# EAGLE design amper (EAGLE 7.6.0)

## Sheet 1 of 2
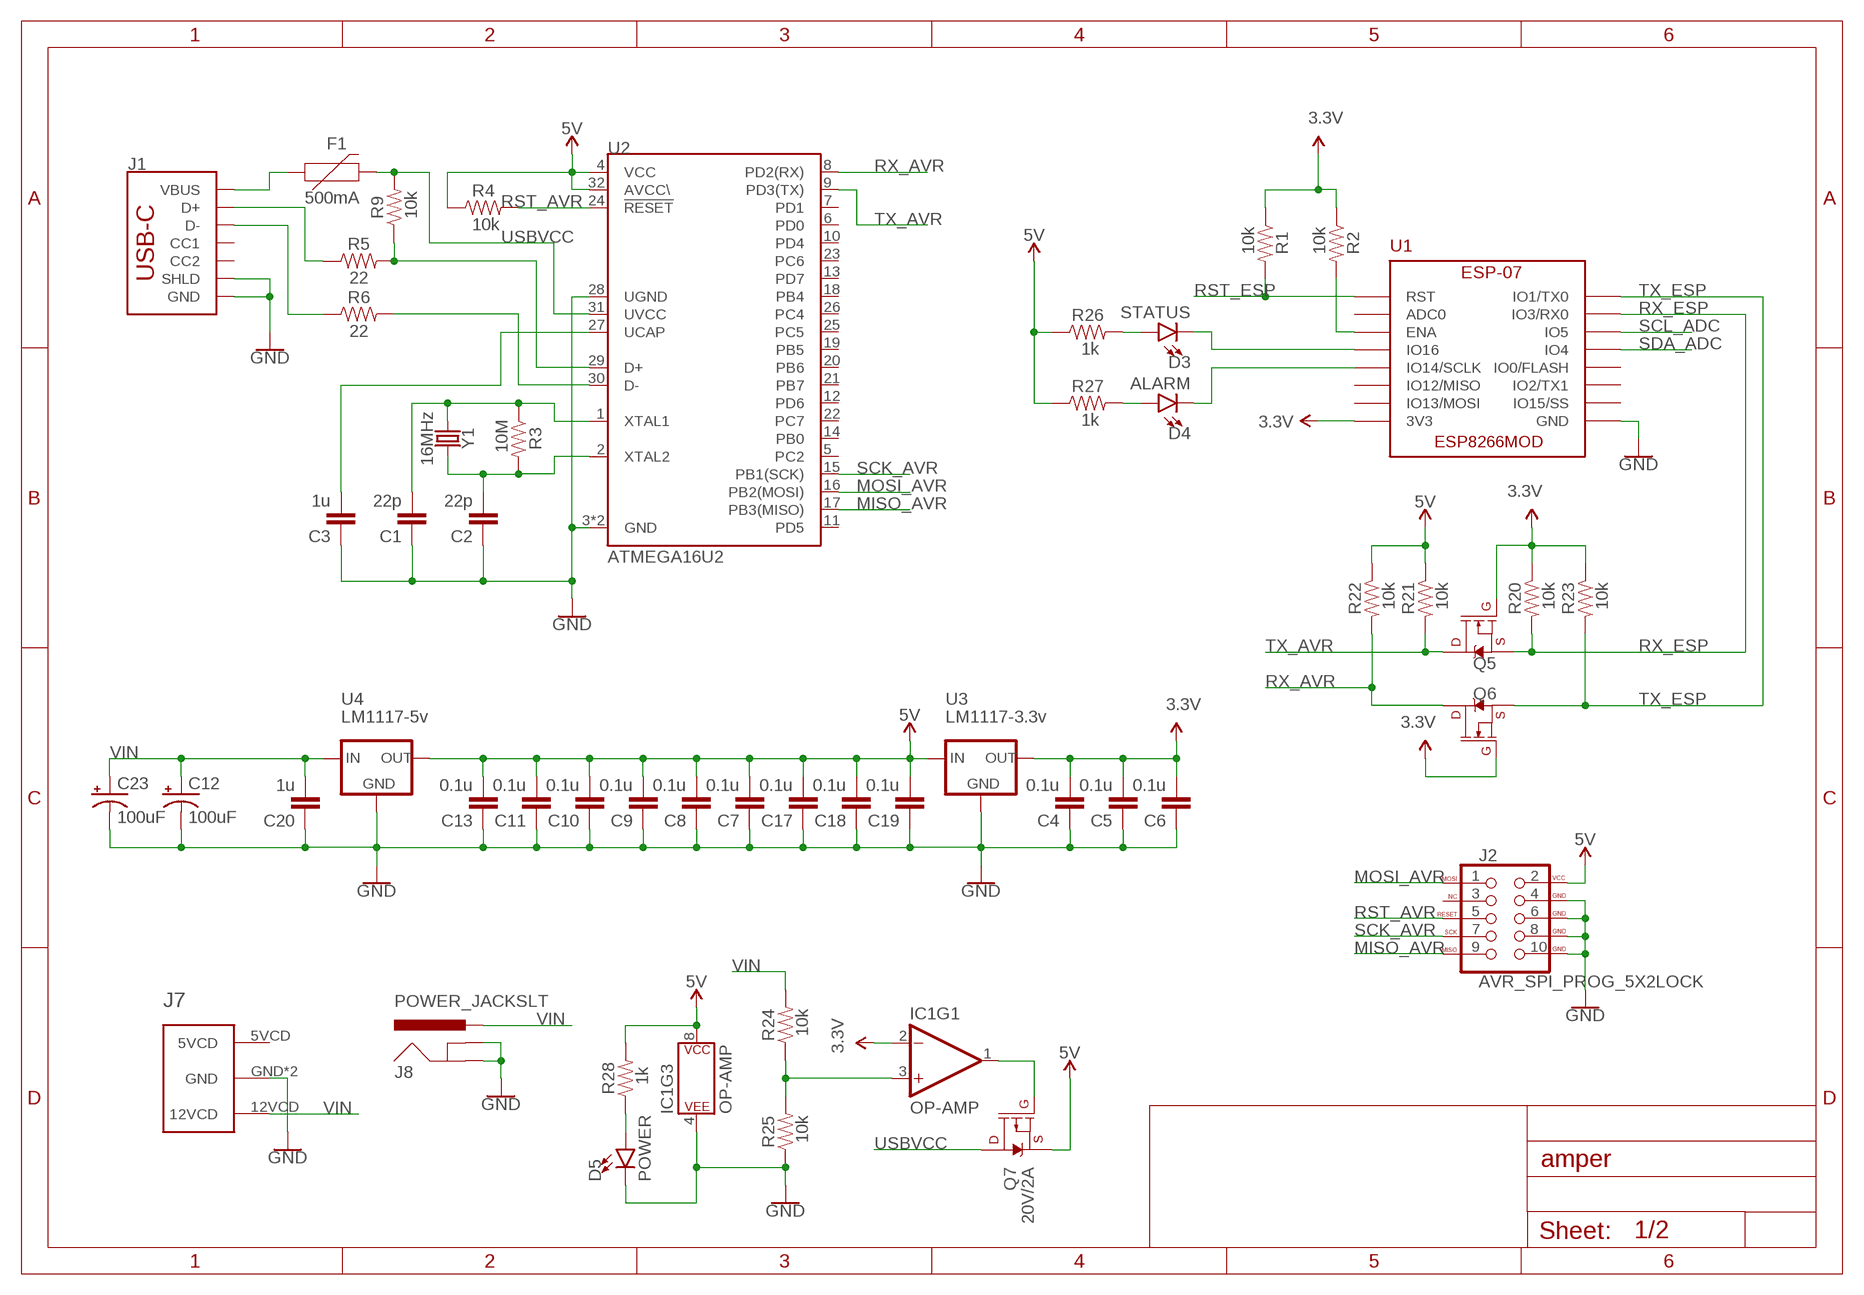
[diagram p0: schematic, sheet 1]

### Parts
C1  22p  CAP-0805  [0805]
C2  22p  CAP-0805  [0805]
C3  1u  CAP-0805  [0805]
C4  0.1u  CAP-0805  [0805]
C5  0.1u  CAP-0805  [0805]
C6  0.1u  CAP-0805  [0805]
C7  0.1u  CAP-0805  [0805]
C8  0.1u  CAP-0805  [0805]
C9  0.1u  CAP-0805  [0805]
C10  0.1u  CAP-0805  [0805]
C11  0.1u  CAP-0805  [0805]
C12  100uF  100UF-POLAR-25V-20%(ELEC)  [PANASONIC_D]
C13  0.1u  CAP-0805  [0805]
C17  0.1u  CAP-0805  [0805]
C18  0.1u  CAP-0805  [0805]
C19  0.1u  CAP-0805  [0805]
C20  1u  CAP-0805  [0805]
C23  100uF  100UF-POLAR-25V-20%(ELEC)  [PANASONIC_D]
D3  STATUS  LED-YELLOW0603  [LED-0603]
D4  ALARM  LED-YELLOW0603  [LED-0603]
D5  POWER  LED-YELLOW0603  [LED-0603]
F1  500mA  PPTC_16V_2.5A  [1812]
IC1  OP-AMP  OPAMP-DUALU  [SO08]
J1  USB_C_2-LAYER_PADS  [USB-C-16P-2LAYER-PADS]
J2  AVR_SPI_PROG_5X2LOCK  [2X5-SHROUDED_LOCK]
J7  MOLEX-CPU-POWER  [MOLEX-5.08-4PIN]
J8  POWER_JACKSLT  [POWER_JACK_SLOT]
Q5  220mA/50V/3.5Ω  MOSFET-NCH-BSS138  [SOT23-3]
Q6  220mA/50V/3.5Ω  MOSFET-NCH-BSS138  [SOT23-3]
Q7  20V/2A  MOSFET_PCH-DMG2305UX-7  [SOT23-3]
R1  10k  RESISTOR0805  [0805]
R2  10k  RESISTOR0805  [0805]
R3  10M  RESISTOR0805  [0805]
R4  10k  RESISTOR0805  [0805]
R5  22  RESISTOR0805  [0805]
R6  22  RESISTOR0805  [0805]
R9  10k  RESISTOR0805  [0805]
R20  10k  RESISTOR0805  [0805]
R21  10k  RESISTOR0805  [0805]
R22  10k  RESISTOR0805  [0805]
R23  10k  RESISTOR0805  [0805]
R24  10k  RESISTOR0805  [0805]
R25  10k  RESISTOR0805  [0805]
R26  1k  RESISTOR0805  [0805]
R27  1k  RESISTOR0805  [0805]
R28  1k  RESISTOR0805  [0805]
U1  ESP-07  [ESP-07]
U2  ATMEGA16U2  [QFN32]
U3  LM1117-3.3v  V_REG_LD1117VXXLD1117-SMD  [SOT223]
U4  LM1117-5v  V_REG_LD1117VXXLD1117-SMD  [SOT223]
Y1  16MHz  CRYSTAL-16MHZSMD-5X3.2  [CRYSTAL-SMD-5X3.2-4PAD]

### Nets
3.3V: C4.2 C5.2 C6.2 IC1.2(-IN) Q5.1(G) Q6.1(G) R1.1 R2.1 R20.1 R23.1 U1.3V3 U3.2(OUT) ; also sheet 2
5V: C7.2 C8.2 C9.2 C10.2 C11.2 C13.2 C17.2 C18.2 C19.2 IC1.8(P$V+) J2.2(VCC) Q7.2(S) R4.1 R21.1 R22.1 R26.1 R27.1 R28.2 U2.4(VCC) U2.32(AVCC\) U3.3(IN) U4.2(OUT) ; also sheet 2
GND: C1.1 C2.1 C3.1 C4.1 C5.1 C6.1 C7.1 C8.1 C9.1 C10.1 C11.1 C12.- C13.1 C17.1 C18.1 C19.1 C20.1 C23.- D5.C IC1.4(P$V-) J1.GND J1.GND2(GND) J1.SHLD1(SHLD) J1.SHLD2(SHLD) J1.SHLD3(SHLD) J1.SHLD4(SHLD) J2.4(GND) J2.6(GND) J2.8(GND) J2.10(GND) J7.GND J7.GND2(GND) J8.GND@1(GNDBREAK) J8.GND@2(GND) R25.1 U1.GND U2.3(GND) U2.28(UGND) U2.EP(GND) U3.1(GND) U4.1(GND) ; also sheet 2
MISO_AVR: J2.9(MISO) U2.17(PB3(MISO))
MOSI_AVR: J2.1(MOSI) U2.16(PB2(MOSI))
N$1: C1.2 R3.1 U2.1(XTAL1) Y1.1
N$2: C2.2 R3.2 U2.2(XTAL2) Y1.3
N$3: C3.2 U2.27(UCAP)
N$6: R6.2 U2.30(D-)
N$7: R5.2 R9.1 U2.29(D+)
N$8: J1.A6(D+) J1.B6(D+) R5.1
N$9: J1.A7(D-) J1.B7(D-) R6.1
N$10: F1.1 J1.VBUS1(VBUS) J1.VBUS2(VBUS)
N$14: R2.2 U1.ENA
N$28: IC1.1(OUT) Q7.1(G)
N$29: IC1.3(+IN) R24.1 R25.2
N$30: D3.C U1.I016(IO16)
N$31: D4.C U1.IO14(IO14/SCLK)
N$32: D3.A R26.2
N$33: D4.A R27.2
N$36: D5.A R28.1
RST_AVR: J2.5(RESET) R4.2 U2.24(!RESET)
RST_ESP: R1.2 U1.RST
RX_AVR: Q6.3(D) R22.2 U2.8(PD2(RX))
RX_ESP: Q5.2(S) R20.2 U1.RX0(IO3/RX0)
SCK_AVR: J2.7(SCK) U2.15(PB1(SCK))
SCL_ADC: U1.IO5 ; also sheet 2
SDA_ADC: U1.IO4 ; also sheet 2
TX_AVR: Q5.3(D) R21.2 U2.9(PD3(TX))
TX_ESP: Q6.2(S) R23.2 U1.TX0(IO1/TX0)
USBVCC: F1.2 Q7.3(D) R9.2 U2.31(UVCC)
VIN: C12.+ C20.2 C23.+ J7.12VCD J8.PWR R24.2 U4.3(IN)
Unconnected: IC1.5(+IN) IC1.6(-IN) IC1.7(OUT) J1.A5(CC1) J1.B5(CC2) J2.3(NC) J7.5VCD U1.ADC(ADC0) U1.IO0(IO0/FLASH) U1.IO2(IO2/TX1) U1.IO12(IO12/MISO) U1.IO13(IO13/MOSI) U1.IO15(IO15/SS) U2.5(PC2) U2.6(PD0) U2.7(PD1) U2.10(PD4) U2.11(PD5) U2.12(PD6) U2.13(PD7) U2.14(PB0) U2.18(PB4) U2.19(PB5) U2.20(PB6) U2.21(PB7) U2.22(PC7) U2.23(PC6) U2.25(PC5) U2.26(PC4)

## Sheet 2 of 2
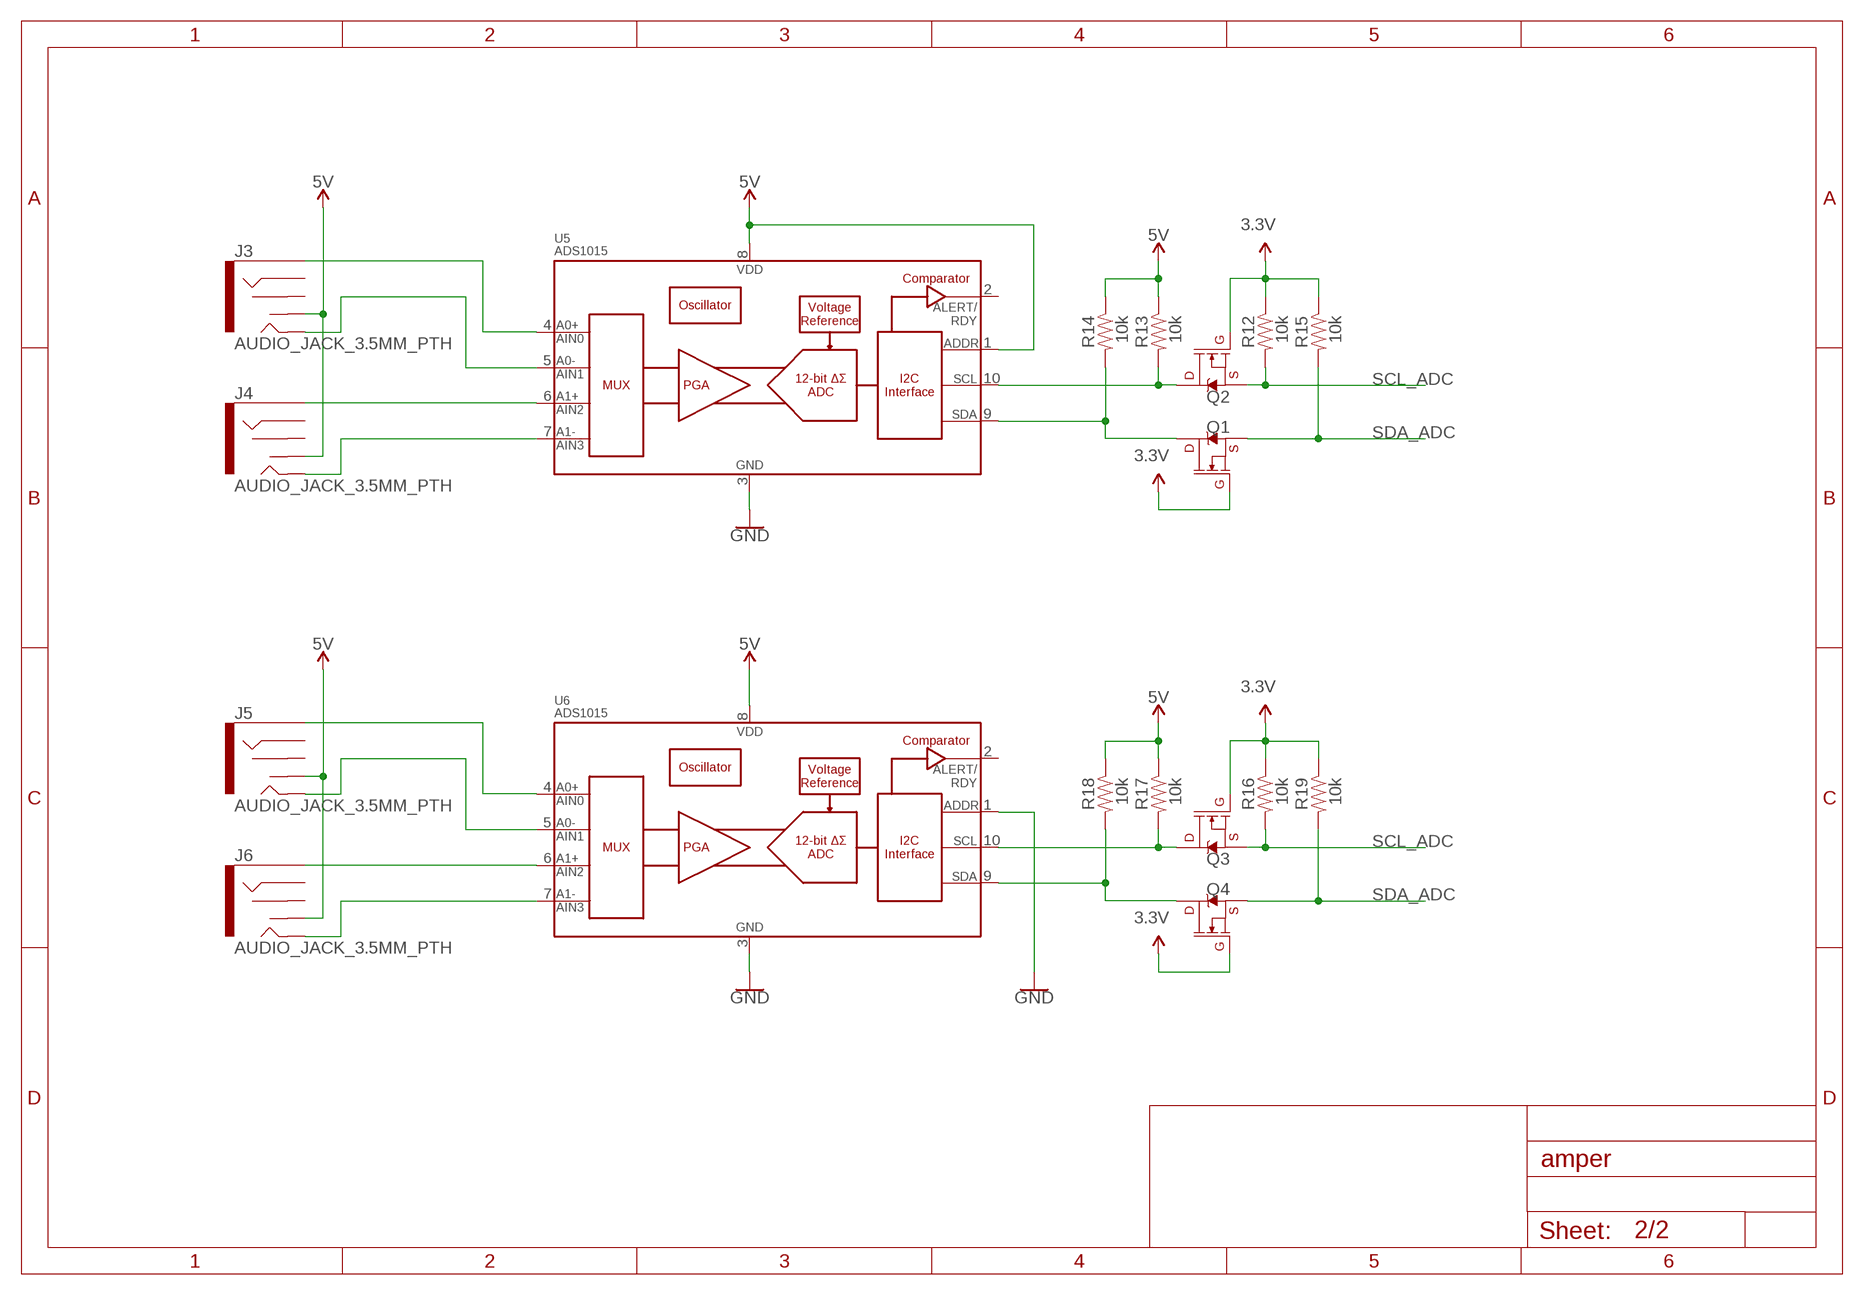
[diagram p1: schematic, sheet 2]

### Parts
J3  AUDIO_JACK_3.5MM_PTH  [AUDIO-JACK]
J4  AUDIO_JACK_3.5MM_PTH  [AUDIO-JACK]
J5  AUDIO_JACK_3.5MM_PTH  [AUDIO-JACK]
J6  AUDIO_JACK_3.5MM_PTH  [AUDIO-JACK]
Q1  220mA/50V/3.5Ω  MOSFET-NCH-BSS138  [SOT23-3]
Q2  220mA/50V/3.5Ω  MOSFET-NCH-BSS138  [SOT23-3]
Q3  220mA/50V/3.5Ω  MOSFET-NCH-BSS138  [SOT23-3]
Q4  220mA/50V/3.5Ω  MOSFET-NCH-BSS138  [SOT23-3]
R12  10k  RESISTOR0805  [0805]
R13  10k  RESISTOR0805  [0805]
R14  10k  RESISTOR0805  [0805]
R15  10k  RESISTOR0805  [0805]
R16  10k  RESISTOR0805  [0805]
R17  10k  RESISTOR0805  [0805]
R18  10k  RESISTOR0805  [0805]
R19  10k  RESISTOR0805  [0805]
U5  ADS1015  [MSOP10]
U6  ADS1015  [MSOP10]

### Nets
3.3V: Q1.1(G) Q2.1(G) Q3.1(G) Q4.1(G) R12.1 R15.1 R16.1 R19.1 ; also sheet 1
5V: J3.TSH J4.TSH J5.TSH J6.TSH R13.1 R14.1 R17.1 R18.1 U5.1(ADDR) U5.8(VDD) U6.8(VDD) ; also sheet 1
GND: U5.3(VSS) U6.1(ADDR) U6.3(VSS) ; also sheet 1
N$16: J3.SLEEVE U5.4(AIN0)
N$17: J3.TIP U5.5(AIN1)
N$18: J4.TIP U5.7(AIN3)
N$19: J4.SLEEVE U5.6(AIN2)
N$20: J5.TIP U6.5(AIN1)
N$21: Q1.3(D) R14.2 U5.9(SDA)
N$22: J5.SLEEVE U6.4(AIN0)
N$23: Q2.3(D) R13.2 U5.10(SCL)
N$24: J6.TIP U6.7(AIN3)
N$25: J6.SLEEVE U6.6(AIN2)
N$26: Q3.3(D) R17.2 U6.10(SCL)
N$27: Q4.3(D) R18.2 U6.9(SDA)
SCL_ADC: Q2.2(S) Q3.2(S) R12.2 R16.2 ; also sheet 1
SDA_ADC: Q1.2(S) Q4.2(S) R15.2 R19.2 ; also sheet 1
Unconnected: J3.RING J3.RSH J4.RING J4.RSH J5.RING J5.RSH J6.RING J6.RSH U5.2(ALERT/RDY) U6.2(ALERT/RDY)

## Library data of the parts
C1-C11 C13 C17-C20 = SparkFun-Capacitors:CAP
C12 C23 = SparkFun-Capacitors:100UF-POLAR: 100µF polarized capacitors A capacitor is a passive two-terminal electrical component used to store electrical energy temporarily in an electric field.; PROD_ID: CAP-12547
D3-D5 = SparkFun-LED:LED-YELLOW: Yellow SMD LED Used in manufacturing several products at SparkFun. Packages: 0603 - SMD 0603 package[Product Link] <http://www.kingbrightusa.com/product.asp?catalog_name=LED&product_id=APT1608SYCK> 0603 -SMART - SMART SMD 0603 package (more efficient/more expensive) [Product Link] <http://www.osram-os.com/osram_os/en/products/product-catalog/led-light-emitting-diodes/smartled-0603/ly-l29k/index.jsp> LilyPad - SMD1206 package[Product Datasheet] <https://www.sparkfun.com/datasheets/DevTools/LilyPad/Q150YUS4.pdf> SparkFun Products: Blynk Board <https://www.sparkfun.com/products/13794> IOIO-OTG <https://www.sparkfun.com/products/13613> XBee Explorer Serial <https://www.sparkfun.com/products/13225>; PROD_ID: DIO-09003; VALUE: Yellow
F1 = SparkFun-Fuses:PPTC: Resettable Fuse PPTC Resettable Fuse. Really a sort of resistor with a polymeric positive temperature coefficient whose resistance increases dramatically with an increase in temperature. When heated by the power passing through the resistance rises causing the current to be limited, protecting the circuit. This is achieved by the transition of the polymer from a crystalline to an amorphous state where the conductive carbon separates breaking the conductive pathways found in the cool crystalline structure. When a PPTC cools back down it resumes conducting letting the circuit turn back on. SparkFun Products: SparkFun RedBoard - Programmed with Arduino <https://www.sparkfun.com/products/12757> Pro Micro - 5V/16MHz <https://www.sparkfun.com/products/12640> Arduino Pro 328 - 5V/16MHz <https://www.sparkfun.com/products/10915> MP3 Trigger <https://www.sparkfun.com/products/13720>; PROD_ID: RES-14390; VALUE: 16V/2.5A(5A TRIP)
IC1 = SparkFun-IC-Amplifiers:OPAMP-DUAL: Generic op-amp footprint This component is for the standard 358 pinning of a dual op-amp From the LM358 datasheet: Pin 1: Output A Pin 2: Inverting Input A Pin 3: Non-Inverting Input A Pin 4: Gnd Pin 5: Non-Inverting Input B Pin 6: Inverting Input B Pin 7: Output B Pin 8: V+; PROD_ID: NA-XXXXX
J1 = SparkFun-Connectors:USB_C: USB Type C 16Pin Connector Super Speed pins not available on the 16-pin purely SMD connector so this part is best for USB 2.0 implementations. D1 and D2 are tied together enabling D+/- no matter which way the cable is plugged into the connector. The two channel configuration pins (CC1/2) are exposed. These are normally connected to ground via 5.1k resistors but can be reconfigured for high current/high power applications. **4-LAYER BOARD WARNING!!** If designing 4-layer board, make sure to select the variant _4-LAYER-ISOLATED. The linked footprint (USB-C-16-4LAYER-ISOLATED) includes some very necessary cutout polygons in the inner layers (2 and 15). This prevents the PTH mounting shield legs on the USB connector from electrically connecting any other polygons on the inner layers (usually VCC and GND).; PROD_ID: CONN-14122
J2 = SparkFun-Connectors:AVR_SPI_PROG_5X2: AVR 10-pin ICSP Header This is the standard AVR In Circuit Serial Programming header. Minimal, but includes pin one indicator. Works with standard Olimex programmers. SparkFun Products: 2x5 AVR ICSP Male Header <https://www.sparkfun.com/products/778> - PTH 2x5 Pin Shrouded Header <https://www.sparkfun.com/products/8506> - PTH2; PROD_ID: CONN-08671; SF_ID: PRT-08506
J3-J6 = SparkFun-Connectors:AUDIO_JACK_3.5MM: Audio Jack 3.5mm variants of PTH and SMT stereo audio jack with bypass switches. SparkFun Products: SparkFun SparkPunk Sound Kit <[https://www.sparkfun.com/products/11177]> - PTH MP3 Trigger <https://www.sparkfun.com/products/13720> -3.5mm SMD SparkFun PicoBoard <https://www.sparkfun.com/products/11888>- 2.5mm SMD; PROD_ID: CONN-08774; SF_ID: PRT-08032
J7 = Cominer-Connectors:MOLEX-CPU-POWER
J8 = SparkFun-Connectors:POWER_JACK: Power Jack Connector This is the standard 5.5mm barrel jack for power. The PTH is the most common, proven, reliable, footprint. The Slot footprint only works if the mill layer is transmitted to the PCB fab house so be warned. Here are the connectors we sell at SparkFun: DC Barrel Power Jack/Connector <https://www.sparkfun.com/products/119> (PRT-00119) DC Barrel Power Jack/Connector (SMD) <https://www.sparkfun.com/products/12748> (PRT-12748) DC Barrel Jack Adapter - Breadboard Compatible <https://www.sparkfun.com/products/10811> (PRT-10811) It is used on this SparkFun product (and many, many others): SparkFun RedBoard - Programmed with Arduino <https://www.sparkfun.com/products/12757> (DEV-12757) Also, if you need a mating power supply or connector, please check these out: Wall Adapter Power Supply - 9VDC 650mA <https://www.sparkfun.com/products/298> (TOL-00298) DC Barrel Jack Adapter - Male <https://www.sparkfun.com/products/10287> (PRT-10287); PROD_ID: PRT-00119
Q1-Q6 = SparkFun-DiscreteSemi:MOSFET-NCH: N-channel MOSFETs Voltage controlled devices that allow control of high current outputs. SparkFun Products: SparkFun OpenScale <https://www.sparkfun.com/products/13261> SparkFun Digital Sandbox <https://www.sparkfun.com/products/12651> SparkFun Monster Moto Shield <https://www.sparkfun.com/products/10182> SparkFun MOSFET Power Controller <https://www.sparkfun.com/products/11214>; PROD_ID: TRANS-00830
Q7 = SparkFun-DiscreteSemi:MOSFET_PCH: P-channel MOSFETs Voltage controlled devices that allow control of high current outputs. SparkFun Products: SparkFun ESP32 Thing <https://www.sparkfun.com/products/13907> SparkFun ESP8266 Thing <https://www.sparkfun.com/products/13231> SparkFun Pi Servo HAT V2 <https://www.sparkfun.com/products/15316> DMG2305UX-7 (20V/4.2A/SOT23-3); PROD_ID: TRAN-14388; VALUE: 20V/4.2A/52mΩ/1.4W
R1-R6 R9 R12-R28 = SparkFun-Resistors:RESISTOR: Generic Resistor Package
U1 = cominer library:ESP-07: Esp-07 Module Wifi ESP8266MOD by COMINER Team
U2 = Cominer-Microcontroller:ATMEGA16U2
U3 U4 = SparkFun-IC-Power:V_REG_LD1117VXX: LD1117VXX voltage regulator. We carry the 3.3V version (COM-00526) in TO-220 package.; PROD_ID: VREG-13917
U5 U6 = SparkFun-IC-Conversion:ADS1015: ADS1015 12-BIT ADC 12-Bit Del-Sig ADC Four single-ended inputs or two differential inputs Internal PGA I2C interface 2.0-5.5V SparkFun Products SparkFun Block for Intel Edison - ADC <https://www.sparkfun.com/products/13770> (DEV-13770); PROD_ID: IC-12270
Y1 = SparkFun-Clocks:CRYSTAL-16MHZ: 16MHz Crystal Digikey Example <http://www.digikey.com/product-search/en?keywords=535-9122-1-ND> Frequency: 16MHz Frequency Stability: ±50ppm Frequency Tolerance: ±20ppm Load Capacitance: 18pF SparkFun Products: Pro Micro -5V/16MHz <https://www.sparkfun.com/products/12640> SparkFun Serial Enabled LCD Kit <https://www.sparkfun.com/products/10097>; PROD_ID: XTAL-08218; SF_ID: COM-00094

## Board
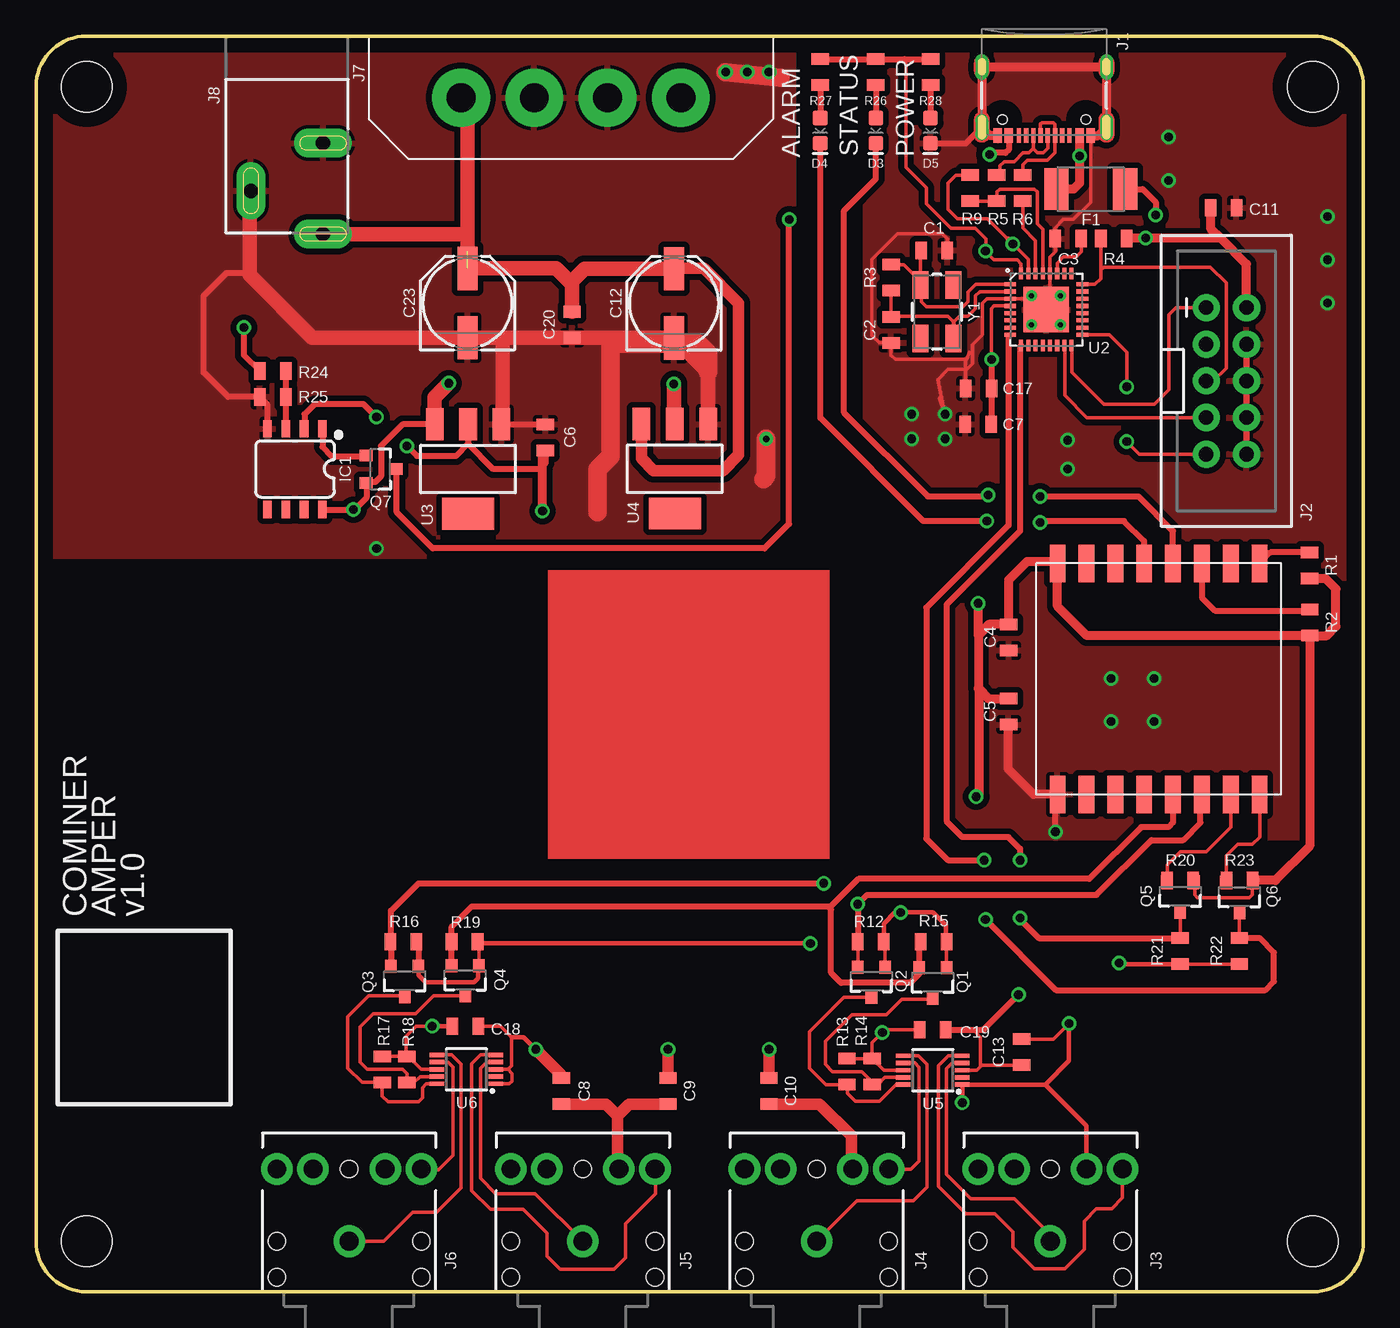
[diagram p2: board, top side]
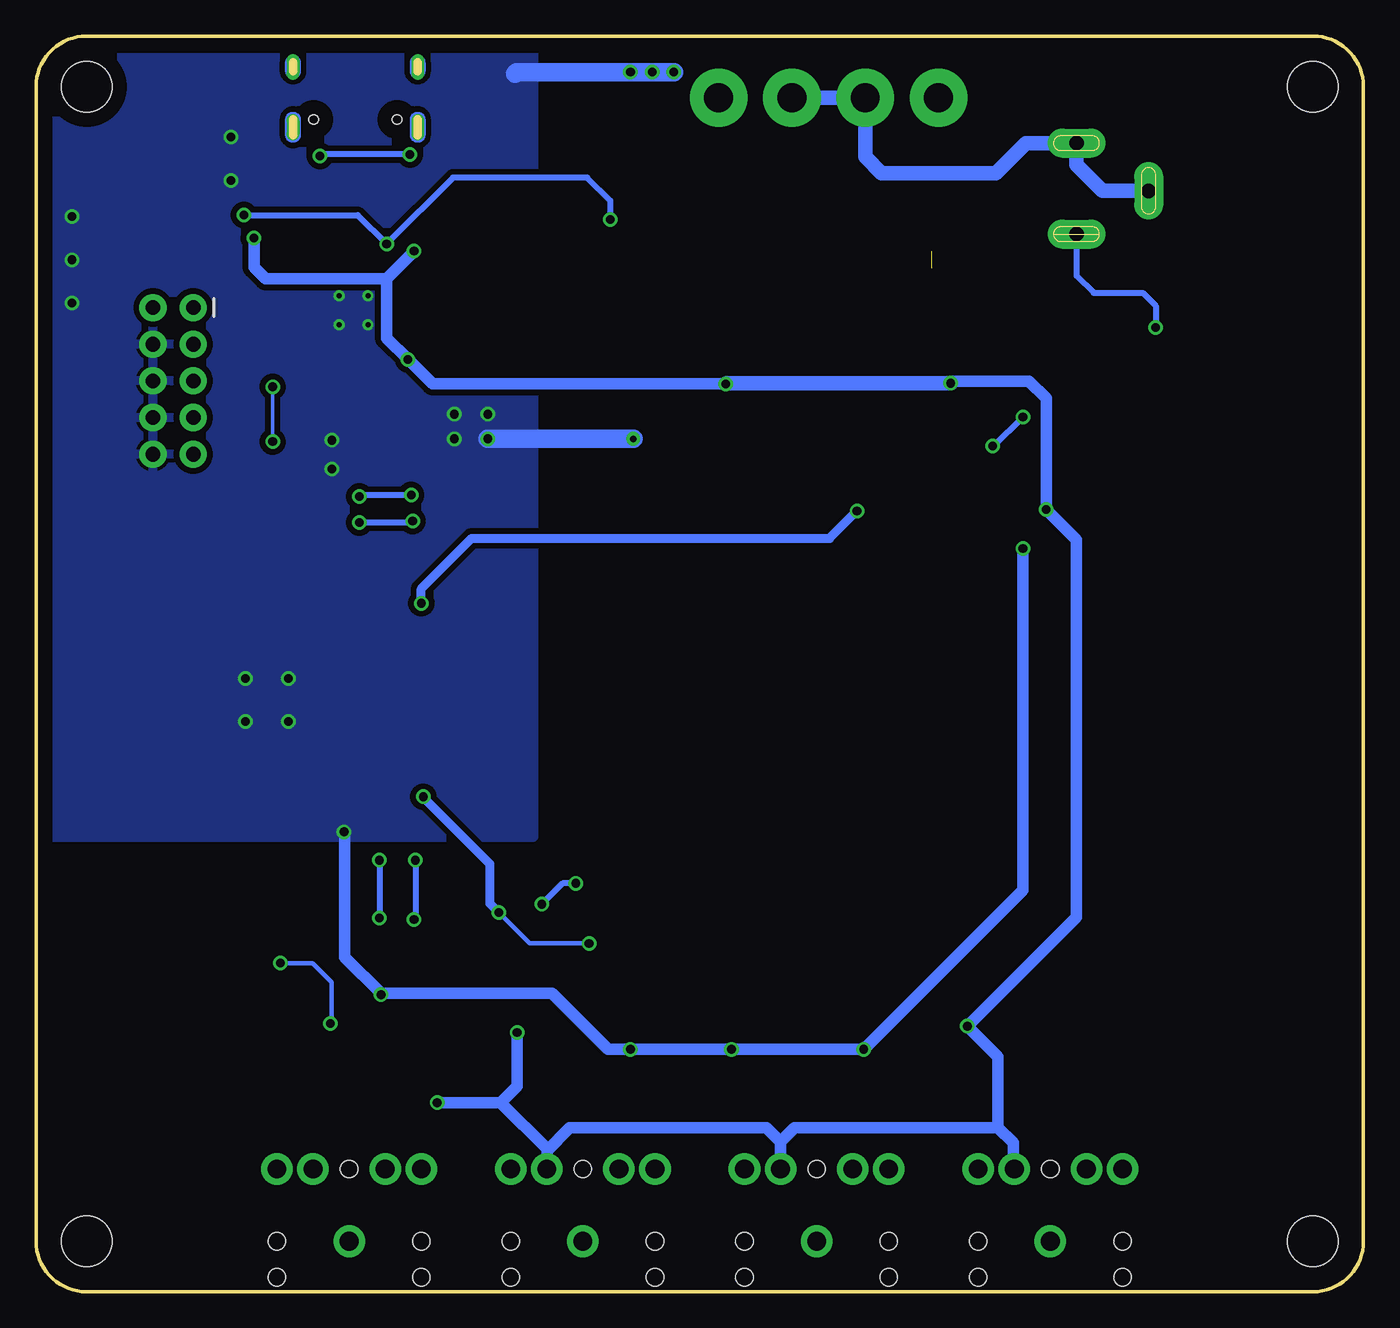
[diagram p3: board, bottom side, seen from below]

Size 92 x 87 mm. Coordinates in mm from the lower left corner, seen from the top.
Outline: 3.5,0 88.5,0 arc90 92,3.5 92,83.5 arc90 88.5,87 3.5,87 arc90 0,83.5 0,3.5 arc90 3.5,0
Copper layers (1*16): Top 0.035mm / dielectric 1.5mm / Bottom 0.035mm
Design rules "default": minimum track width 6mil, minimum drill 0.35mm, track to track 6mil, track to pad 6mil, pad to pad 6mil, via to via 6mil, smd to smd 6mil, copper to edge 40mil, drill to drill 6mil, minimum pad ring 10mil, minimum via ring 8mil, stop-mask expansion 4mil, vias tented up to drill 0mil, thermal gap 10mil
Holes 3.5 mm at 3.5,3.5 88.5,3.5 88.5,83.5 3.5,83.5

### Footprints (pad centres in the part's own frame; a part is rotated, then mirrored left to right if it is on the bottom)
0805 = smd 0.8 x 1.2: 1 -0.9,0; 2 0.9,0
PANASONIC_D = smd 3 x 1.4: + 2.4,0; - -2.4,0
LED-0603 = smd 1 x 1: A -0.877,0; C 0.877,0
1812 = smd 1.676 x 2.896: 1 -2.388,0; 2 2.388,0
SO08 = smd 0.6 x 1.2: 1 -1.905,-2.8; 2 -0.635,-2.8; 3 0.635,-2.8; 4 1.905,-2.8; 5 1.905,2.8; 6 0.635,2.8; 7 -0.635,2.8; 8 -1.905,2.8
USB-C-16P-2LAYER-PADS = smd 0.3 x 1: A5 -1.25,-0.34; A6 -0.25,-0.34; A7 0.25,-0.34; A8 1.25,-0.34; B5 1.75,-0.34; B6 0.75,-0.34; B7 -0.75,-0.34; B8 -1.75,-0.34 | smd 0.6 x 1: GND -3.225,-0.34; GND2 3.225,-0.34; VBUS1 -2.45,-0.34; VBUS2 2.45,-0.34 | drill 0.4 pad 0.6 long: SHLD1 -4.318,-0.915; SHLD2 4.318,-0.915; SHLD3 -4.318,-5.095; SHLD4 4.318,-5.095 | hole 0.65: -2.89,-1.445; 2.89,-1.445
2X5-SHROUDED_LOCK = drill 1.016 pad 1.88: 1 -1.397,5.08; 2 1.397,5.08; 3 -1.397,2.54; 4 1.397,2.54; 5 -1.397,0; 6 1.397,0; 7 -1.397,-2.54; 8 1.397,-2.54; 9 -1.397,-5.08; 10 1.397,-5.08
AUDIO-JACK = drill 1.3 pad 2.184: RING 5,5; RSH 5,2.5; SLEEVE 0,0; TIP 5,-5; TSH 5,-2.5 | hole 1.2: 0,5; -2.5,5; -2.5,-5; 0,-5; 5,0
MOLEX-5.08-4PIN = drill 2 pad 4: 5VCD 7.62,0; 12VCD -7.62,0; GND -2.54,0; GND2 2.54,0
POWER_JACK_SLOT = drill 1 pad 2 long: GND@1 2.58,7.5; GND@2 7.58,10.8; PWR 2.58,13.8
SOT23-3 = smd 0.8 x 0.9: 1 -0.95,-1; 2 0.95,-1; 3 0,1.1
ESP-07 = smd 2.6 x 1.1: 3V3 0,1.5; ADC 0,13.5; ENA 0,11.5; GND 16,1.5; I016 0,9.5; IO0 16,7.5; IO2 16,5.5; IO4 16,9.5; IO5 16,11.5; IO12 0,5.5; IO13 0,3.5; IO14 0,7.5; IO15 16,3.5; RST 0,15.5; RX0 16,13.5; TX0 16,15.5
QFN32 = smd 0.285 x 0.8: 1 -1.04,-2.5; 2 -0.54,-2.5; 3 -0.04,-2.5; 4 0.46,-2.5; 5 0.96,-2.5; 6 1.46,-2.5; 7 1.96,-2.5; 8 2.46,-2.5; 17 2.46,2.5; 18 1.96,2.5; 19 1.46,2.5; 20 0.96,2.5; 21 0.46,2.5; 22 -0.04,2.5; 23 -0.54,2.5; 24 -1.04,2.5 | smd 0.8 x 0.285: 9 3.21,-1.75; 10 3.21,-1.25; 11 3.21,-0.75; 12 3.21,-0.25; 13 3.21,0.25; 14 3.21,0.75; 15 3.21,1.25; 16 3.21,1.75; 25 -1.79,1.75; 26 -1.79,1.25; 27 -1.79,0.75; 28 -1.79,0.25; 29 -1.79,-0.25; 30 -1.79,-0.75; 31 -1.79,-1.25; 32 -1.79,-1.75 | smd 3.15 x 3.15: EP 0.71,0
SOT223 = smd 1.219 x 2.235: 1 -2.311,-3.099; 2 0,-3.099; 3 2.311,-3.099 | smd 3.6 x 2.2: 4 0,3.099
MSOP10 = smd 0.3 x 1: 1 -1,-2.05; 2 -0.5,-2.05; 3 0,-2.05; 4 0.5,-2.05; 5 1,-2.05; 6 1,2.05; 7 0.5,2.05; 8 0,2.05; 9 -0.5,2.05; 10 -1,2.05
CRYSTAL-SMD-5X3.2-4PAD = smd 1.9 x 1.1: 1 -1.85,-1.15; 2 1.85,-1.15; 3 1.85,1.15; 4 -1.85,1.15

### Placement (x,y rotation side)
C1  62.26,72.15 180 top
C2  59.26,66.64 90 top
C3  71.54,72.97 0 top
C4  67.42,45.34 90 top
C5  67.4,40.2 90 top
C6  35.3,59.2 270 top
C7  65.3,60.1 0 top
C8  36.4,13.9 270 top
C9  43.8,13.9 270 top
C10  50.8,13.9 270 top
C11  82.3,75.1 180 top
C12  44.22,68.48 90 top
C13  68.3,16.6 90 top
C17  65.32,62.59 0 top
C18  29.75,18.4 180 top
C19  62.15,18.15 180 top
C20  37.15,67 90 top
C23  29.9,68.5 90 top
D3  58.2,80.45 270 top
D4  54.35,80.45 270 top
D5  62,80.45 270 top
F1  73.1,76.4 0 top
IC1  17.95,56.99 180 top
J1  69.87,79.77 180 top
J2  82.5,63.11 0 top
J3  70.3,3.5 90 top
J4  54.1,3.5 90 top
J5  37.9,3.5 90 top
J6  21.7,3.5 90 top
J7  37.07,82.73 0 top
J8  22.47,87.08 180 top
Q1  62.15,21.45 180 top
Q2  57.9,21.5 180 top
Q3  25.55,21.55 180 top
Q4  29.75,21.6 180 top
Q5  79.3,27.4 180 top
Q6  83.41,27.37 180 top
Q7  23.86,56.99 270 top
R1  88.26,50.32 90 top
R2  88.28,46.36 90 top
R3  59.26,70.26 270 top
R4  74.7,72.97 180 top
R5  66.57,76.46 270 top
R6  68.38,76.46 270 top
R9  64.75,76.46 90 top
R12  57.85,24.25 180 top
R13  56.2,15.25 270 top
R14  57.95,15.25 270 top
R15  62.2,24.25 180 top
R16  25.45,24.25 180 top
R17  24,15.4 270 top
R18  25.7,15.4 270 top
R19  29.7,24.25 180 top
R20  79.3,28.5 180 top
R21  79.3,23.6 90 top
R22  83.4,23.6 90 top
R23  83.4,28.5 180 top
R24  16.4,63.8 180 top
R25  16.4,62 0 top
R26  58.2,84.5 270 top
R27  54.35,84.5 270 top
R28  62,84.5 90 top
U1  69.3,50.46 270 top
U2  70.02,68.76 270 top
U3  29.94,57 180 top
U4  44.27,57.02 180 top
U5  62.15,15.35 90 top
U6  29.83,15.41 90 top
Y1  62.44,67.89 270 top

### Tracks (layer width: path | path; a pad name or v marks a point on that pad's centre or on a via)
3.3V  (via drill 0.6)
  Top 0.254: R15.1 Q1.1 | R12.1 58.85,24.15 Q2.1 | R19.1 30.7,24.15 Q4.1 | R20.1 80.2,28.45 Q5.1 80.3,28.35 80.3,27.5 80.5,27.3 84.1,27.3 84.3,27.5 84.3,28.43 | R23.1 84.3,28.43 | 84.3,28.43 Q6.1
  Top 0.305: 26.5,24.1 26.5,21.94 26.99,21.45 30.36,21.45 30.62,21.71 30.62,22.52 Q4.1 | 30.7,24.15 v53.66,24.15 v53.67,24.14 | R15.1 63.05,24.3 63.05,25.4 62.17,26.28 v59.93,26.28 59.53,26.28 58.75,25.5 R12.1
  Top 0.406: R16.1 26.5,24.1 Q3.1 | U3.2 29.94,58.74 | 29.94,58.74 29.1,57.9 26.4,57.9 v25.7,58.6 | v23.6,60.6 22.7,61.5 19.3,61.5 18.6,60.8 18.6,59.8 IC1.2 | C6.2 35.3,57.4 34.9,57 31.68,57 29.94,58.74 | 66,41.1 66,41.16 65.35,41.81
  Top 0.61: 65.3,45.5 66.04,46.24 C4.2 67.42,49.32 68.7,50.6 70.66,50.6 U1.3V3 70.8,47.5 72.84,45.46 R2.1 | 65.3,45.5 65.3,41.8 66,41.1 C5.2 | R2.1 89.46,45.46 90.1,46.1 90.1,48.7 89.4,49.4 88.28,49.4 R1.1 | R2.1 88.28,30.88 85.9,28.5 R23.1 | 65.35,41.81 65.35,34.49 v65.16,34.3 | 65.3,45.5 v65.3,47.7 | v35.1,54.1 35.1,58.1 C6.2
  Bottom 0.305: v53.67,24.14 57.79,24.14 v59.93,26.28
  Bottom 0.406: v25.7,58.6 25.6,58.6 v23.6,60.6
  Bottom 0.61: v65.16,34.3 65.16,34.25 60.56,29.65 60.56,26.91 v59.93,26.28 | v65.3,47.7 65.3,48.7 61.8,52.2 37,52.2 v35.1,54.1
5V  (via drill 0.6)
  Top 0.254: U6.8 26.7,15.4 25.8,16.3 R18.1 | R17.1 R18.1 | R13.1 R14.1 | R14.1 58.75,15.35 U5.8 | R14.1 57.95,17.25 v58.66,17.96 58.85,18.15 C19.2 | v27.45,18.4 26.35,18.4 25.65,17.7 25.65,16.35 R18.1 | R21.1 R22.1 | U2.4 66.4,68.3 66.22,68.12 v66.22,64.6 | U2.32 68.27,71.23 68,71.5 66.4,71.5 65.85,72.05 65.85,72.95 65.1,73.7 63.4,73.7 61.7,75.4 61.7,76.5 60.3,77.9 60.3,85.3 60.2,85.4 | C13.2 70.52,17.5 v71.6,18.58
  Top 0.305: 69.95,14.35 U5.1 v64.2,13.1 | 69.95,14.35 72.8,11.5 J3.TSH | R21.1 75.13,22.7 v75.06,22.77 | v71.6,18.58 71.6,16 69.95,14.35 | v27.45,18.4 C18.2
  Top 0.406: R27.1 R26.1 60.2,85.4 R28.2 | IC1.8 v21.99,54.19 | U3.3 25.4,60.1 23.9,58.6 23.9,56.5 23.5,56.1 22.92,56.1 Q7.2 22.9,56 22.9,55 22,54.1 | R4.1 76.87,72.97 v76.9,73 | v65.8,72.1 65.85,72.05 | v66.22,64.6 C17.2 66.22,60.12 C7.2
  Top 0.61: J2.2 83.9,71.2 82.1,73 | 82.1,73 v76.9,73 75.63,73 R4.1 | C11.2 81.4,73.7 82.1,73
  Top 0.813: C8.2 39.5,13 40.3,12.2 | 40.3,12.2 40.3,8.6 J5.TSH | C10.2 54.3,13 56.5,10.8 56.5,8.6 J4.TSH | C9.2 41.1,13 40.3,12.2
  Top 1.016: U3.3 27.63,61.98 v28.6,62.95 | v44.2,62.9 44.2,60.19 U4.2
  Bottom 0.305: 56.6,9.9 56.6,9.78 | J5.TSH | v75.06,22.77 72.82,22.77 71.51,21.46 71.51,18.67 v71.6,18.58 | 24.27,8.57 J6.TSH
  Bottom 0.813: v64.2,13.1 59.8,13.1 | 59.8,13.1 58.66,14.24 v58.66,17.96 | 59.8,13.1 56.6,9.9 | J4.TSH 56.6,9.78 55.01,11.37 41.38,11.37 40.41,10.4 | J5.TSH 40.41,10.4 | 40.41,10.4 39.44,11.37 25.33,11.37 | 25.33,11.37 24.27,10.31 24.27,8.57 | 25.33,11.37 25.33,16.28 v27.45,18.4 19.89,25.96 19.89,52.09 v21.99,54.19 21.99,61.89 23.2,63.1 28.45,63.1 arc-90 v28.6,62.95 | v76.9,73 76.9,71 76.1,70.2 67.7,70.2 | 67.7,70.2 v65.8,72.1 | 67.7,70.2 67.7,66.08 v66.22,64.6 64.52,62.9 v44.2,62.9
  Bottom 1.016: v28.6,62.95 44.15,62.95 v44.2,62.9
GND  (via drill 0.35 pad 0.55, 0.45 pad 0.95, 0.6)
  Top 0.254: J1.GND 73.09,75.5 71.9,74.3 71.2,74.3 70.6,73.7 70.6,73.01 C3.1 70.64,72.04 70.27,71.67 U2.28 70.27,68.3 U2.EP 69.27,68.8 U2.3 65.9,68.8 65.6,68.5 65.6,66.3 64.9,65.6 64.9,64.3 64.5,63.9 63.2,63.9 62.5,63.2 v63,60.8 62.6,61.9 | C1.1 63.15,72.95 62.8,73.3 59.7,73.3 57.95,71.55 57.95,66.25 58.45,65.75 C2.1 59.25,64.9 59.55,64.6 64.5,64.6 | C19.1 64.95,18.15 65.45,17.65 65.45,15.8 | 65.45,15.8 65.45,15.6 65.2,15.35 U5.3 | C18.1 32.2,18.4 32.95,17.65 32.95,15.65 32.71,15.41 | 32.71,15.41 U6.3 | U6.1 32.8,14.4 33,14.6 33,15.12 32.71,15.41 | C17.1 64.42,64.52 64.5,64.6 | 64.5,64.6 64.7,65.1 | C13.1 65.55,15.7 65.45,15.8
  Top 0.305: 32.95,17.65 33.78,17.65 v34.63,16.8
  Top 0.406: D5.C 64.44,79.57 J1.SHLD2 | IC1.4 16.05,61.45 R25.1 13.3,62 11.6,63.7 11.6,69 13.2,70.6 14.8,70.6 | U3.1 C6.1 | J2.4 J2.6 J2.8 J2.10 | C19.1 65.66,18.15 v68.09,20.58 | v70.65,31.87 70.65,34.31 U1.GND
  Top 0.61: J1.GND2 66.13,80.11 J1.SHLD2 J1.SHLD4 J1.SHLD3 J1.SHLD1 73.61,80.11 J1.GND | U1.GND 69.14,34.46 67.4,36.2 C5.1
  Top 0.813: v23.6,51.5 23.6,51.6 | C8.1 36.4,15.03 v34.63,16.8 | C9.1 v43.8,16.8 | C10.1 v50.8,16.8
  Top 1.016: C23.- C20.1 44.2,66.1 C12.- 46.58,63.72 U4.1 | C23.- 32.3,66.1 32.35,66.05 32.35,60.2 U3.1 | C23.- 19.15,66.1 14.8,70.45 14.8,70.6 14.8,76.19 J8.GND@2
  Top 1.27: 46.58,63.72 46.58,65.02 45.9,65.7 39.9,65.7 39.8,65.6 39.8,57.9 38.9,57 38.9,54 | 51.6,84.1 v47.8,84.5 | v50.6,59.1 50.6,56.5 50.4,56.3
  Bottom 0.305: 67.99,20.68 v68.09,20.58
  Bottom 0.406: v68.09,20.58 68.09,20.67 | 70.6,31.62 v70.65,31.87
  Bottom 0.813: 68.09,20.67 70.6,23.18 70.6,31.62 | 67.99,20.68 56.25,20.68 52.37,16.8 v50.8,16.8 v43.8,16.8 v34.63,16.8 23.6,27.83 v23.6,51.5
  Bottom 1.016: J8.GND@2 18.09,76.28 19.89,78.08 J8.GND@1 23.39,79.58 25.47,77.5 33.4,77.5 34.53,78.63 J7.GND J7.GND2
  Bottom 1.27: v47.8,84.5 58.7,84.5 58.8,84.4 | v60.7,59.1 v50.6,59.1
  other vias: 74.5,42.5 77.5,42.5 77.5,39.5 74.5,39.5 78.5,80 78.5,77 71.5,59 71.5,57 89.5,71.5 89.5,74.5 89.5,68.5 60.7,60.8 63,59.1 49.3,84.5 50.8,84.5 71,69 71,67 69,67 69,69
  pour Top (isolate 0.406): -2.5,51 52.5,51 52.5,89.5 -2.5,89.5
  pour Top (isolate 0.406): 57.5,89.5 57.5,31.5 94.5,31.5 94.5,89.5
  pour Bottom (isolate 0.406): 57.5,90.5 95.5,90.5 95.5,31.5 57.5,31.5
MISO_AVR  (via drill 0.6)
  Top 0.254: J2.9 76.47,58.03 v75.6,58.9 | v75.6,62.7 75.6,65.1 74.4,66.3 U2.17
  Bottom 0.254: v75.6,58.9 v75.6,62.7
MOSI_AVR
  Top 0.254: J2.1 78.99,68.19 78.5,67.7 78.5,62.5 77.5,61.5 74,61.5 71.8,63.7 71.8,65.52 U2.16
N$1
  Top 0.254: U2.1 65.15,69.8 64.6,69.25 64.6,68.6 64.25,68.25 61.7,68.25 61.35,68.6 61.35,69.68 Y1.1 | C1.2 61.29,72.08 Y1.1 | R3.1 60.16,71.16 61.29,70.03 Y1.1
N$2
  Top 0.254: U2.2 65.4,69.3 65.1,69 65.1,68.1 64.6,67.6 64,67.6 63.6,67.2 Y1.3 63.59,67.21 63.2,67.6 59.32,67.6 C2.2 R3.2
N$3
  Top 0.254: U2.27 70.77,71.27 71.2,71.7 72.1,71.7 72.44,72.04 C3.2
N$6
  Top 0.254: R6.2 68.38,73.72 69.27,72.83 U2.30
N$7
  Top 0.254: R9.1 R5.2 66.6,75.59 66.6,76.2 66.8,76.4 69.2,76.4 69.4,76.2 69.4,74 69.77,73.63 U2.29
N$8
  Top 0.254: 66.5,77.43 R5.1 66.8,77.49 66.8,78 67.1,78.3 67.8,78.3 68.4,78.9 68.8,78.9 69.12,79.22 J1.B6 69.12,79.18 69.4,78.9 69.8,78.9 70.12,79.22 J1.A6
N$9
  Top 0.254: J1.A7 69.62,80.92 69.7,81 70.5,81 70.6,80.9 70.6,80.13 J1.B7 70.62,78.92 70.1,78.4 68.7,78.4 68.4,78.1 68.4,77.38 R6.1
N$10  (via drill 0.6)
  Top 0.254: 72.3,80.13 J1.VBUS1
  Top 0.406: J1.VBUS2 67.42,79.12 67.2,78.9 66.2,78.9 v66.1,78.8
  Top 0.61: 70.71,76.8 F1.1 71.9,76.4 72.32,76.82 v72.32,78.7 J1.VBUS1
  Bottom 0.406: v66.1,78.8 72.22,78.8 v72.32,78.7
N$14
  Top 0.254: 88.22,47.2 R2.2
  Top 0.406: U1.ENA 80.8,48.1 81.7,47.2 88.22,47.2
N$16
  Top 0.254: J3.SLEEVE 70.3,3.95 67.8,6.45 64.8,6.45 63.1,8.15 63.1,15.45 63.5,15.85 U5.4
N$17
  Top 0.254: J3.TIP 75.3,6.5 74.55,5.75 73.5,5.75 72.65,4.9 72.65,2.95 71.3,1.6 69.2,1.6 67.7,3.1 67.7,4.15 66.45,5.4 64.45,5.4 62.55,7.3 62.55,15.65 63.25,16.35 U5.5
N$18
  Top 0.254: U5.7 60.9,15.85 61.2,15.55 61.2,9.05 60.65,8.5 J4.TIP
N$19
  Top 0.254: U5.6 61.15,16.35 61.75,15.75 61.75,7.25 60.8,6.3 56.9,6.3 J4.SLEEVE
N$20
  Top 0.254: U6.5 30.81,16.41 30.2,15.8 30.2,7 31.5,5.7 33.75,5.7 35.4,4.05 35.4,2.45 36.3,1.55 40.05,1.55 40.85,2.35 40.85,4.7 42.95,6.8 42.95,8.45 J5.TIP
N$21
  Top 0.254: U5.9 58.85,14.85 58.35,14.35 R14.2 57.95,14.55 57.25,15.25 55.2,15.25 54.7,15.75 54.7,17.35 56.55,19.2 58.95,19.2 60,20.25 62.05,20.25 Q1.3
N$22
  Top 0.254: J5.SLEEVE 34.6,6.8 31.85,6.8 30.8,7.85 30.8,15.5 31.21,15.91 U6.4
N$23
  Top 0.254: U5.10 59.6,14.35 58.45,13.2 56.8,13.2 56.25,13.75 56.25,14.3 R13.2 54.75,14.35 53.6,15.5 53.6,18 56,20.4 Q2.3
N$24
  Top 0.254: J6.TIP 26.75,8.45 27.9,8.45 28.9,9.45 28.9,15.55 28.54,15.91 U6.7
N$25
  Top 0.254: J6.SLEEVE 24.1,3.5 26.1,5.5 27.75,5.5 29.45,7.2 29.45,15.75 28.79,16.41 U6.6
N$26
  Top 0.254: U6.10 27.05,14.4 26.8,14.15 26.8,13.45 26.5,13.15 24.4,13.15 24,13.55 R17.2 22.6,14.5 21.6,15.5 21.6,19.05 23.05,20.5 25.5,20.5 Q3.3
N$27
  Top 0.254: U6.9 26.6,14.9 26.2,14.5 R18.2 25.7,15.1 25.4,15.4 22.95,15.4 22.45,15.9 22.45,18.35 23.35,19.25 26.3,19.25 27.55,20.5 Q4.3
N$28
  Top 0.406: IC1.1 19.86,58.55 20.5,57.9 22.82,57.9 Q7.1
N$29
  Top 0.406: R24.1 R25.2 17.3,59.8 IC1.3
N$30  (via drill 0.6)
  Top 0.406: U1.I016 78.8,52.7 76.4,55.1 v69.6,55.1 | D3.C 58.2,77.1 56,74.9 56,60.9 61.8,55.1 65.9,55.1 v66,55.2
  Bottom 0.406: v66,55.2 69.5,55.2 v69.6,55.1
N$31  (via drill 0.6)
  Top 0.406: U1.IO14 76.8,52 75.4,53.4 69.7,53.4 v69.6,53.3 | D4.C 54.35,60.55 61.5,53.4 v65.9,53.4
  Bottom 0.406: v69.6,53.3 66,53.3 v65.9,53.4
N$32
  Top 0.406: R26.2 D3.A
N$33
  Top 0.406: R27.2 D4.A
N$36
  Top 0.406: R28.1 D5.A
RST_AVR
  Top 0.254: U2.24 73.4,69.8 73.8,70.2 73.8,70.8 | 73.8,70.8 R4.2 | J2.5 81.61,63.11 82.5,64 82.5,69.9 81.4,71 74,71 73.8,70.8
RST_ESP
  Top 0.406: R1.2 85.56,51.22 U1.RST
RX_AVR  (via drill 0.6)
  Top 0.254: R22.2 Q6.3
  Top 0.406: U2.8 67.4,66.18 67.4,53.1 61.7,47.4 61.7,31.4 63.2,29.9 v65.7,29.9 | v65.8,25.8 70.7,20.9 85.2,20.9 85.8,21.5 85.8,23.5 84.8,24.5 R22.2
  Bottom 0.406: v65.7,29.9 65.7,25.9 v65.8,25.8
RX_ESP
  Top 0.254: U1.RX0 82.8,32.2 81.1,30.5 79.3,30.5 78.4,29.6 R20.2 78.35,28.45 Q5.2
SCK_AVR
  Top 0.254: J2.7 72.83,60.57 71.3,62.1 71.3,65.52 U2.15
SCL_ADC  (via drill 0.6)
  Top 0.254: R12.2 Q2.2
  Top 0.406: R16.2 24.6,24.2 | 24.6,24.2 Q3.2 | U1.IO5 80.7,34.36 80.7,32.5 79.5,31.3 77.3,31.3 73.5,27.5 57.6,27.5 v56.95,26.85 R12.2 | 24.6,24.2 24.6,26.4 26.5,28.3 v54.6,28.3
  Bottom 0.406: v54.6,28.3 55.5,28.3 v56.95,26.85
SDA_ADC
  Top 0.254: R15.2 61.2,24.15 Q1.2 | Q4.2 R19.2
  Top 0.406: 61.2,24.15 61.2,22 60.6,21.4 55.8,21.4 55.1,22.1 55.1,26.5 | 55.1,26.5 55.1,26.7 57,28.6 73,28.6 76.6,32.2 78.5,32.2 78.8,32.5 U1.IO4 78.8,34.4 | Q4.2 28.8,25.3 30.2,26.7 54.9,26.7 55.1,26.5
TX_AVR  (via drill 0.6)
  Top 0.254: R21.2 Q5.3
  Top 0.406: U2.9 68.2,65.48 68.2,52.7 63.1,47.6 63.1,32.6 64.2,31.5 67.4,31.5 68.2,30.7 v68.2,29.9 | v68.2,25.9 68.2,25.8 69.5,24.5 R21.2
  Bottom 0.406: v68.2,29.9 v68.2,25.9
TX_ESP
  Top 0.254: U1.TX0 84.8,31.5 84.3,31 83.3,31 82.5,30.2 R23.2 82.5,28.41 Q6.2
USBVCC  (via drill 0.6)
  Top 0.254: R9.2 63.76,77.36 63.2,76.8 63.2,75 63.85,74.35 65.95,74.35 67.4,72.9 | v67.7,72.6 68.77,71.53 U2.31
  Top 0.406: F1.2 76.7,76.4 77.6,75.5 v77.6,74.6 | v67.7,72.6 67.4,72.9 | v52.2,74.3 52.2,53.2 50.5,51.5 27.5,51.5 25,54 25,56.95 Q7.3
  Bottom 0.406: v77.6,74.6 69.7,74.6 v67.7,72.6 63.1,77.2 53.8,77.2 52.2,75.6 v52.2,74.3
VIN  (via drill 0.6)  (1 unrouted)
  Top 0.406: v14.4,66.8 14.4,64.9 R24.2
  Top 0.813: U4.3 41.96,57.74 42.8,56.9 47.6,56.9 48.7,58 48.7,68.5 46.3,70.9 44.24,70.9 C12.+
  Top 1.016: C12.+ 38.03,70.88 37.15,70 37.15,69.8 | 37.15,69.8 C20.2 | 37.15,69.8 36.05,70.9 C23.+ 29.9,73.28 J8.PWR | 29.9,72.1 29.9,82.28 J7.12VCD
  Bottom 0.406: J8.PWR 19.89,70.39 18.7,69.2 15.3,69.2 14.4,68.3 v14.4,66.8
(copper drawn outside any net)
  shapes: Top area x1

### Text on the board
tPlace: COMINER | AMPER | v1.0
tNames: U2
200bmp: MINER PUNK